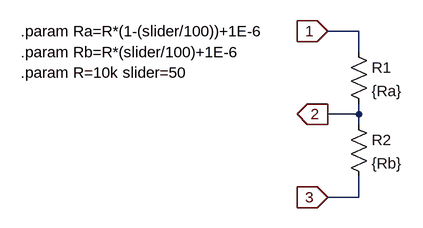
[diagram p0: schematic potentiometer.asc]
potentiometer.asc, the LTspice schematic file:
Version 4.1
SHEET 1 880 680
WIRE 128 32 80 32
WIRE 128 64 128 32
WIRE 128 160 128 144
WIRE 128 160 80 160
WIRE 128 176 128 160
WIRE 128 288 128 256
WIRE 128 288 80 288
FLAG 80 32 1
IOPIN 80 32 In
FLAG 80 160 2
IOPIN 80 160 Out
FLAG 80 288 3
IOPIN 80 288 In
SYMBOL res 112 48 R0
SYMATTR InstName R1
SYMATTR Value {Ra}
SYMBOL res 112 160 R0
SYMATTR InstName R2
SYMATTR Value {Rb}
TEXT -392 32 Left 2 !.param Ra=R*(1-(slider/100))+1E-6
TEXT -392 64 Left 2 !.param Rb=R*(slider/100)+1E-6
TEXT -392 96 Left 2 !.param R=10k slider=50

The netlist it stands for:
* potentiometer.asc
R1 1 2 {Ra}
R2 2 3 {Rb}
.param Ra=R*(1-(slider/100))+1E-6
.param Rb=R*(slider/100)+1E-6
.param R=10k slider=50
.backanno
.end